# Altium project chinook_pcb_rotor.PrjPcb (part 1 of 2)
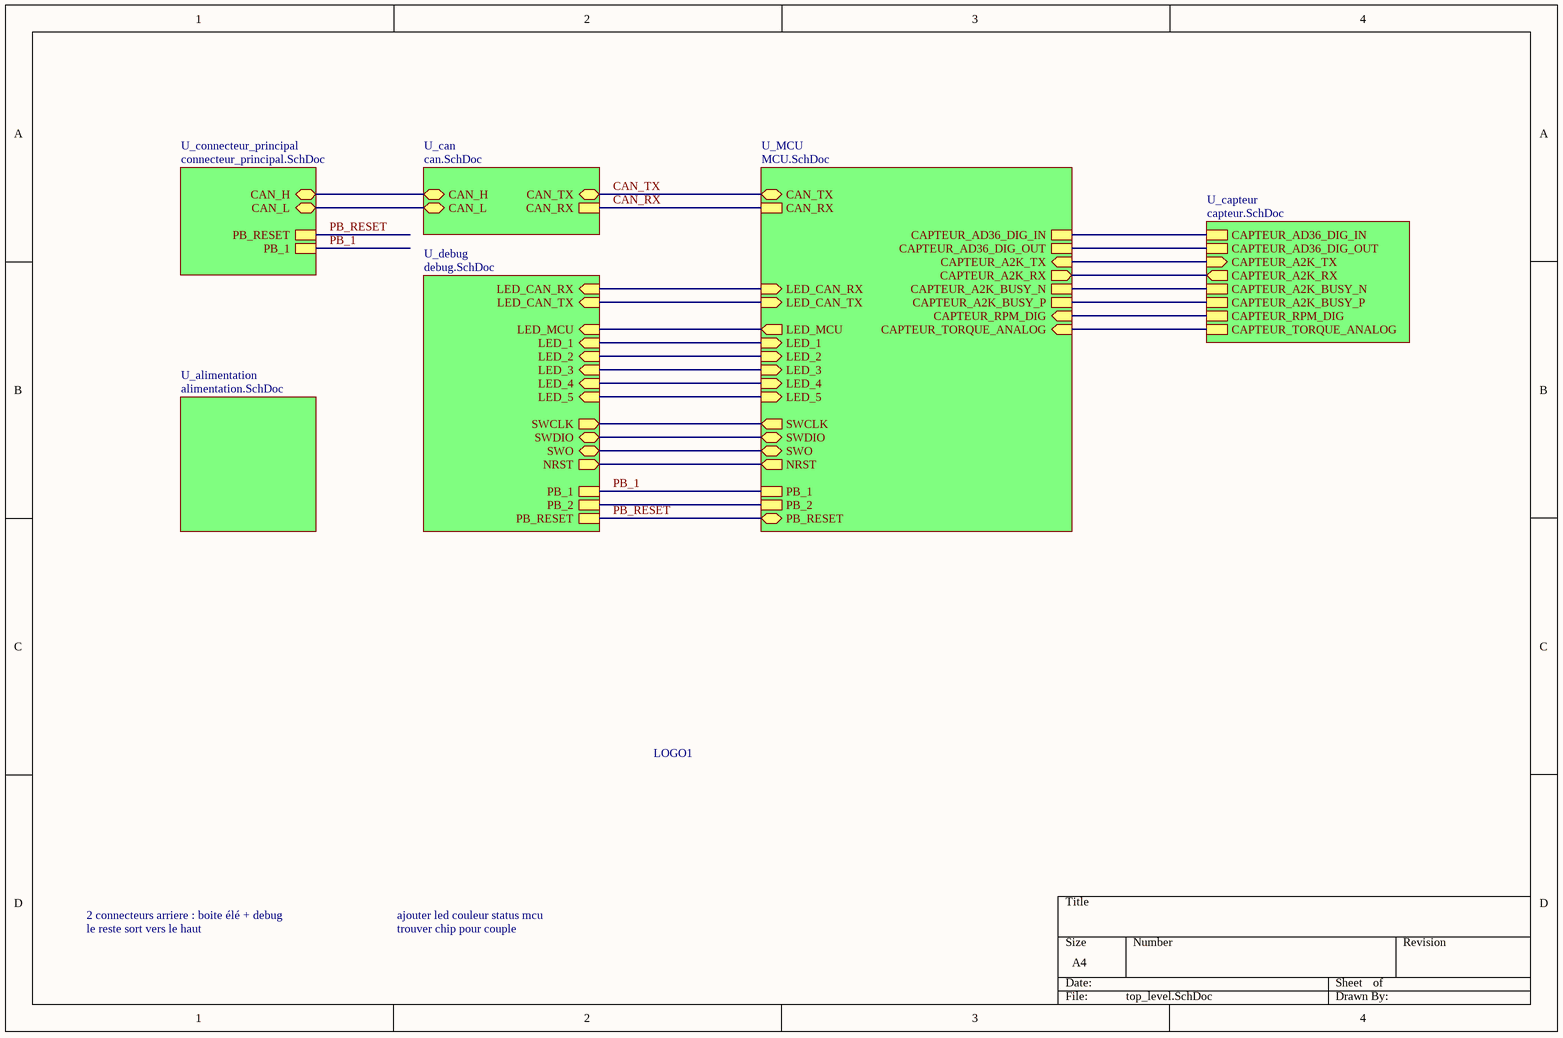
[diagram p0: top_level.SchDoc]
11 sheets, 93 parts. Net scope: hierarchical (ports join the sheet entries above them; power ports are global).
Board file: chinook_pcb_rotor.PcbDoc
Sheets:
  top_level.SchDoc
    U_MCU = MCU.SchDoc
    U_capteur = capteur.SchDoc
      U_capteur_couple = capteur_couple.SchDoc
      U_encodeur_pale = encodeur_pale.SchDoc
      U_encodeur_rotor_rpm = encodeur_rotor_rpm.SchDoc
    U_can = can.SchDoc
    U_debug = debug.SchDoc
      U_led = led.SchDoc
    U_alimentation = alimentation.SchDoc
    U_connecteur_principal = connecteur_principal.SchDoc

## Sheet top_level.SchDoc
size A4; SheetNumber: 1; SheetTotal: 11

### Parts
LOGO1  VOTRE NOM DE LOGO  [LOGO-CHINOOK]  (value not drawn)

### Sub-sheets
U_alimentation = alimentation.SchDoc: no entries
U_can = can.SchDoc: CAN_H (bidir), CAN_L (bidir), CAN_TX (bidir), CAN_RX
U_capteur = capteur.SchDoc: CAPTEUR_AD36_DIG_IN, CAPTEUR_AD36_DIG_OUT, CAPTEUR_A2K_TX (in), CAPTEUR_A2K_RX (out), CAPTEUR_A2K_BUSY_N, CAPTEUR_A2K_BUSY_P, CAPTEUR_RPM_DIG, CAPTEUR_TORQUE_ANALOG
U_connecteur_principal = connecteur_principal.SchDoc: CAN_H (bidir), CAN_L (bidir), PB_1, PB_RESET
U_debug = debug.SchDoc: LED_CAN_RX (in), LED_CAN_TX (in), SWCLK (out), SWDIO (bidir), SWO (bidir), NRST (out), LED_1 (in), LED_MCU (in), LED_2 (in), LED_3 (in), LED_4 (in), LED_5 (in), PB_1, PB_2, PB_RESET
U_MCU = MCU.SchDoc: SWCLK (out), SWDIO (bidir), SWO (bidir), NRST (out), CAPTEUR_AD36_DIG_IN, CAPTEUR_AD36_DIG_OUT, CAPTEUR_A2K_TX (in), CAPTEUR_A2K_RX (out), CAPTEUR_A2K_BUSY_N, CAPTEUR_A2K_BUSY_P, LED_CAN_RX (in), LED_CAN_TX (in), LED_1 (in), LED_2 (in), LED_3 (in), LED_4 (in), LED_5 (in), PB_1, CAPTEUR_TORQUE_ANALOG (in), CAN_RX, LED_MCU (out), PB_RESET (bidir), PB_2, CAPTEUR_RPM_DIG (in), CAN_TX (bidir)

### Nets
CAN_RX: sheet U_MCU/CAN_RX, sheet U_can/CAN_RX
CAN_TX: sheet U_MCU/CAN_TX, sheet U_can/CAN_TX
PB_1: sheet U_MCU/PB_1, sheet U_debug/PB_1, sheet U_connecteur_principal/PB_1
PB_2: sheet U_MCU/PB_2, sheet U_debug/PB_2
PB_RESET: sheet U_MCU/PB_RESET, sheet U_debug/PB_RESET, sheet U_connecteur_principal/PB_RESET
NetJ4_5: sheet U_can/CAN_H, sheet U_connecteur_principal/CAN_H
NetJ4_6: sheet U_can/CAN_L, sheet U_connecteur_principal/CAN_L
NetR14_2: sheet U_MCU/LED_MCU, sheet U_debug/LED_MCU
NetR18_1: sheet U_MCU/CAPTEUR_RPM_DIG, sheet U_capteur/CAPTEUR_RPM_DIG
NetR20_1: sheet U_MCU/CAPTEUR_TORQUE_ANALOG, sheet U_capteur/CAPTEUR_TORQUE_ANALOG
(unnamed): sheet U_MCU/SWCLK, sheet U_debug/SWCLK
(unnamed): sheet U_MCU/SWDIO, sheet U_debug/SWDIO
(unnamed): sheet U_MCU/SWO, sheet U_debug/SWO
(unnamed): sheet U_MCU/NRST, sheet U_debug/NRST
(unnamed): sheet U_MCU/CAPTEUR_AD36_DIG_IN, sheet U_capteur/CAPTEUR_AD36_DIG_IN
(unnamed): sheet U_MCU/CAPTEUR_AD36_DIG_OUT, sheet U_capteur/CAPTEUR_AD36_DIG_OUT
(unnamed): sheet U_MCU/CAPTEUR_A2K_TX, sheet U_capteur/CAPTEUR_A2K_TX
(unnamed): sheet U_MCU/CAPTEUR_A2K_RX, sheet U_capteur/CAPTEUR_A2K_RX
(unnamed): sheet U_MCU/CAPTEUR_A2K_BUSY_N, sheet U_capteur/CAPTEUR_A2K_BUSY_N
(unnamed): sheet U_MCU/CAPTEUR_A2K_BUSY_P, sheet U_capteur/CAPTEUR_A2K_BUSY_P
(unnamed): sheet U_MCU/LED_CAN_RX, sheet U_debug/LED_CAN_RX
(unnamed): sheet U_MCU/LED_CAN_TX, sheet U_debug/LED_CAN_TX
(unnamed): sheet U_MCU/LED_1, sheet U_debug/LED_1
(unnamed): sheet U_MCU/LED_2, sheet U_debug/LED_2
(unnamed): sheet U_MCU/LED_3, sheet U_debug/LED_3
(unnamed): sheet U_MCU/LED_4, sheet U_debug/LED_4
(unnamed): sheet U_MCU/LED_5, sheet U_debug/LED_5

### Notes on the sheet
- 2 connecteurs arriere : boite élé + debug
- ajouter led couleur status mcu
- le reste sort vers le haut
- trouver chip pour couple

### Library data of the parts
LOGO1 = LOGO - FOOTPRINT

## Sheet MCU.SchDoc
size A4; SheetNumber: 2; SheetTotal: 11
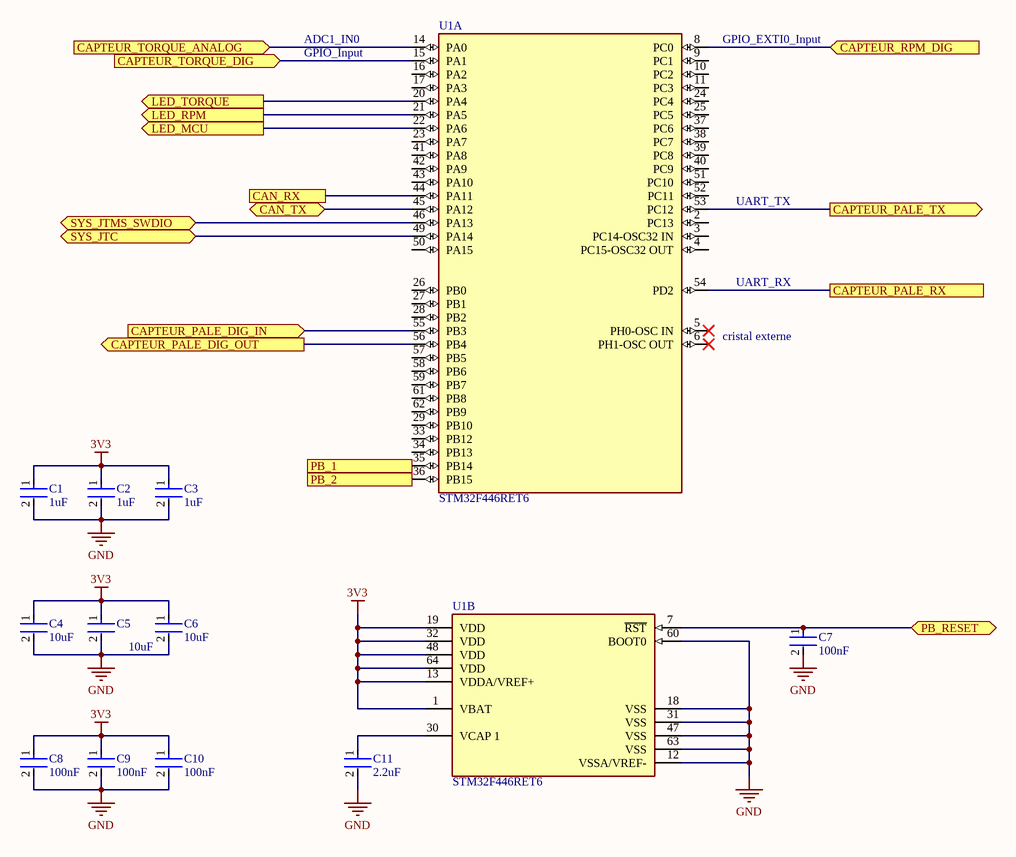
[diagram p1: MCU.SchDoc]

### Parts
C1  1uF  [FP-GRM155-0_05-IPC_A]
C2  1uF  [FP-GRM155-0_05-IPC_A]
C3  1uF  [FP-GRM155-0_05-IPC_A]
C4  10uF  [FP-GRM155-0_15-MFG]
C5  10uF  [FP-GRM155-0_15-MFG]
C6  10uF  [FP-GRM155-0_15-MFG]
C7  100nF  [FP-CL278-IPC_A]
C8  100nF  [FP-CL278-IPC_A]
C9  100nF  [FP-CL278-IPC_A]
C10  100nF  [FP-CL278-IPC_A]
C11  2.2uF  [FP-GRM155-0_05-MFG]
U1  STM32F446RET6  [FP-LQFP64-5W-IPC_A]  (parts A,B of 2)

### Ports
CAN_RX, CAN_TX (bidir), CAPTEUR_PALE_DIG_IN (in), CAPTEUR_PALE_DIG_OUT (out), CAPTEUR_PALE_RX, CAPTEUR_PALE_TX (out), CAPTEUR_RPM_DIG (in), CAPTEUR_TORQUE_ANALOG (in), CAPTEUR_TORQUE_DIG (in), LED_MCU (out), LED_RPM (out), LED_TORQUE (out), PB_1, PB_2, PB_RESET (bidir), SYS_JTC (bidir), SYS_JTMS_SWDIO (bidir)

### Nets
3V3: C1.1 C2.1 C3.1 C4.1 C5.1 C6.1 C8.1 C9.1 C10.1 U1.1(VBAT) U1.13(VDDA/VREF+) U1.19(VDD) U1.32(VDD) U1.48(VDD) U1.64(VDD)
GND: C1.2 C2.2 C3.2 C4.2 C5.2 C6.2 C7.2 C8.2 C9.2 C10.2 C11.2 U1.12(VSSA/VREF-) U1.18(VSS) U1.31(VSS) U1.47(VSS) U1.60(BOOT0) U1.63(VSS)
CAN_RX: U1.44(PA11) ; port CAN_RX
CAN_TX: U1.45(PA12) ; port CAN_TX
PB_1: U1.35(PB14) ; port PB_1
PB_2: U1.36(PB15) ; port PB_2
PB_RESET: C7.1 U1.7(~{RST}) ; port PB_RESET
NetC11_1: C11.1 U1.30(VCAP_1)
NetR14_2: U1.22(PA6) ; port LED_MCU
NetR18_1: U1.8(PC0) ; port CAPTEUR_RPM_DIG
NetR20_1: U1.14(PA0) ; port CAPTEUR_TORQUE_ANALOG
NetU1_15: U1.15(PA1) ; port CAPTEUR_TORQUE_DIG
NetU1_20: U1.20(PA4) ; port LED_TORQUE
NetU1_21: U1.21(PA5) ; port LED_RPM
NetU1_46: U1.46(PA13) ; port SYS_JTMS_SWDIO
NetU1_49: U1.49(PA14) ; port SYS_JTC
NetU1_53: U1.53(PC12) ; port CAPTEUR_PALE_TX
NetU1_54: U1.54(PD2) ; port CAPTEUR_PALE_RX
NetU1_55: U1.55(PB3) ; port CAPTEUR_PALE_DIG_IN
NetU1_56: U1.56(PB4) ; port CAPTEUR_PALE_DIG_OUT

Not connected (* = marked no-connect by the designer): U1 2(PC13) 3(PC14-OSC32_IN) 4(PC15-OSC32_OUT) 5(PH0-OSC_IN)* 6(PH1-OSC_OUT)* 9(PC1) 10(PC2) 11(PC3) 16(PA2) 17(PA3) 23(PA7) 24(PC4) 25(PC5) 26(PB0) 27(PB1) 28(PB2) 29(PB10) 33(PB12) 34(PB13) 37(PC6) 38(PC7) 39(PC8) 40(PC9) 41(PA8) 42(PA9) 43(PA10) 50(PA15) 51(PC10) 52(PC11) 57(PB5) 58(PB6) 59(PB7) 61(PB8) 62(PB9)

### Notes on the sheet
- ADC1_IN0
- GPIO_Input
- (near U1) GPIO_EXTI0_Input
- UART_TX
- (near U1) cristal externe
- UART_RX

### Library data of the parts
C1-C3 = GRM155R61E105MA12D: Multilayer Ceramic Capacitor, 1 uF, 25 V, ± 20%, X5R, 0402 [1005 Metric]; Manufacturer: Murata; Voltage Rating: 25V; Supplier: Digikey; Supplier Part Number: 490-10018-1-ND; Manufacturer Part Number: GRM155R61E105MA12D; RoHS: Yes; Category: Ceramic Capacitors; Stock: 2496490; Pricing: 1=0.1, 10=0.066, 50=0.0376, 100=0.0292, 500=0.022, 1000=0.01728, 2500=0.01571, 5000=0.01445 (USD); Mounting Technology: Surface Mount; Case/Package: 0402; Case Code (Metric): 1005; Case Code (Imperial): 0402; Weight: 0.000212oz; Min Operating Temperature: -55°C; Max Operating Temperature: 85°C; Value: 1uF; Packaging: Tape and Reel; Tolerance: 20%; Dielectric: X5R; Termination: SMD/SMT; Voltage Rating (DC): 25V; Package Quantity: 10000; Series: GRM; Length: 0.039inch; Width: 0.02inch; Height: 0.5mm; Thickness: 0.022inch; RoHS Compliant: Yes; ComponentLink1URL: http://www.mouser.com/ds/2/281/c02e-2905.pdf?src-supplier=Mouser; ComponentLink1Description: http://www.mouser.com/ds/2/281/c02e-2905.pdf?src-supplier=Mouser; ComponentLink2URL: https://datasheet.octopart.com/GRM155R61E105MA12D-Murata-datasheet-149523023.pdf?src-supplier=Newark; ComponentLink2Description: https://datasheet.octopart.com/GRM155R61E105MA12D-Murata-datasheet-149523023.pdf?src-supplier=Newark; ComponentLink3URL: https://datasheet.octopart.com/GRM155R61E105MA12D-Murata-datasheet-22122223.pdf?src-supplier=Future+Electronics; ComponentLink3Description: https://datasheet.octopart.com/GRM155R61E105MA12D-Murata-datasheet-22122223.pdf?src-supplier=Future+Electronics; ComponentLink4URL: http://search.murata.co.jp/Ceramy/image/img/A01X/G101/ENG/GRM155R61E105MA12-01.pdf?src-supplier=Digikey; ComponentLink4Description: http://search.murata.co.jp/Ceramy/image/img/A01X/G101/ENG/GRM155R61E105MA12-01.pdf?src-supplier=Digikey
C4-C6 = GRM155R60J106ME15D: Multilayer Ceramic Capacitor, 10 uF, 6.3 V, ± 20%, X5R, 0402 [1005 Metric]; Manufacturer: Murata; Material: 4241ConductorMaterial; Voltage Rating: 6.3V; Supplier: Digikey; Supplier Part Number: 490-13238-1-ND; Manufacturer Part Number: GRM155R60J106ME15D; RoHS: Yes; Category: Ceramic Capacitors; Stock: 6215687; Pricing: 1=0.17, 10=0.11, 50=0.0696, 100=0.0557, 500=0.04022, 1000=0.03558, 2500=0.03404, 5000=0.03094 (USD); Mounting Technology: Surface Mount; Case/Package: 0402; Case Code (Metric): 1005; Case Code (Imperial): 0402; Min Operating Temperature: -55°C; Max Operating Temperature: 85°C; Packaging: Cut Tape; Value: 10uF; Tolerance: 20%; Voltage Rating (DC): 6.3V; Dielectric: X5R; Series: GRM; Length: 0.039inch; Width: 0.02inch; Height: 650um; Thickness: 0.026inch; RoHS Compliant: Yes; ComponentLink1URL: https://datasheet.octopart.com/GRM155R60J106ME15D-Murata-datasheet-149522992.pdf?src-supplier=Newark; ComponentLink1Description: https://datasheet.octopart.com/GRM155R60J106ME15D-Murata-datasheet-149522992.pdf?src-supplier=Newark; ComponentLink2URL: https://www.murata.com/~/media/webrenewal/support/library/catalog/products/capacitor/mlcc/c02e.ashx?la=en-us&src-supplier=Digikey; ComponentLink2Description: https://www.murata.com/~/media/webrenewal/support/library/catalog/products/capacitor/mlcc/c02e.ashx?la=en-us&src-supplier=Digikey; ComponentLink3URL: https://datasheet.octopart.com/GRM155R60J106ME15D-Murata-datasheet-165579666.pdf?src-supplier=TME; ComponentLink3Description: https://datasheet.octopart.com/GRM155R60J106ME15D-Murata-datasheet-165579666.pdf?src-supplier=TME
C7-C10 = CL05A104KA5NNNC: Multilayer Ceramic Capacitor, 0.1 uF, 25 V, ± 10%, X5R, 0402 [1005 Metric]; Manufacturer: Samsung; Material: 4241ConductorMaterial; Voltage Rating: 25V; Supplier: Digikey; Supplier Part Number: 1276-1043-1-ND; Manufacturer Part Number: CL05A104KA5NNNC; RoHS: Yes; Category: Ceramic Capacitors; Stock: 11930039; Pricing: 1=0.1, 10=0.01, 50=0.0054, 100=0.0042, 500=0.00318, 1000=0.0025, 2500=0.00227, 5000=0.00209 (USD); Mounting Technology: Surface Mount; Case/Package: 0402; Case Code (Metric): 1005; Case Code (Imperial): 0402; Min Operating Temperature: -55°C; Max Operating Temperature: 85°C; Value: 100nF; Packaging: Tape and Reel; Tolerance: 10%; Dielectric: X5R; Voltage: 25V; Series: CL; Construction: Flat; Package Quantity: 1; Voltage Rating (DC): 25V; Length: 1mm; Width: 0.02inch; Height: 0.5mm; Depth: 0.5mm; Thickness: 0.022inch; Radiation Hardening: No; RoHS Compliant: Yes; Lead Free: Lead Free; ComponentLink1URL: https://datasheet.ciiva.com/25802/cl05a104ka5nnnc-25802704.pdf?src-supplier=Digikey; ComponentLink1Description: https://datasheet.ciiva.com/25802/cl05a104ka5nnnc-25802704.pdf?src-supplier=Digikey; ComponentLink2URL: https://datasheet.ciiva.com/16437/cl05a104ka5nnnc-16437369.pdf?src-supplier=Future+Electronics; ComponentLink2Description: https://datasheet.ciiva.com/16437/cl05a104ka5nnnc-16437369.pdf?src-supplier=Future+Electronics; ComponentLink3URL: https://datasheet.ciiva.com/26838/getdatasheetpartid-357412-26838142.pdf?src-supplier=Verical; ComponentLink3Description: https://datasheet.ciiva.com/26838/getdatasheetpartid-357412-26838142.pdf?src-supplier=Verical; ComponentLink4URL: https://datasheet.ciiva.com/26309/mlcc-catalogdownload2013-eng-26309014.pdf?src-supplier=Distrelec; ComponentLink4Description: https://datasheet.ciiva.com/26309/mlcc-catalogdownload2013-eng-26309014.pdf?src-supplier=Distrelec
C11 = GRM155C80J225KE95D: Cap Ceramic 2.2uF 6.3V X6S 10% Pad SMD 0402 105°C T/R; Manufacturer: Murata; Supplier: Digikey; Supplier Part Number: 490-10012-1-ND; Manufacturer Part Number: GRM155C80J225KE95D; RoHS: Yes; Category: Ceramic Capacitors; Stock: 6441444; Pricing: 1=0.1, 10=0.054, 50=0.031, 100=0.0241, 500=0.01814, 1000=0.01425, 2500=0.01296, 5000=0.01192 (USD); Mounting Technology: Surface Mount; Case/Package: 0402; Case Code (Metric): 1005; Material: Ceramic; Case Code (Imperial): 0402; Min Operating Temperature: -55°C; Max Operating Temperature: 105°C; Tolerance: 10%; Value: 2.2uF; Packaging: Cut Tape; Voltage Rating: 6.3V; Voltage Rating (DC): 6.3V; Series: GRM; Length: 0.039inch; Width: 0.02inch; Height: 0.3mm; Thickness: 0.022inch; RoHS Compliant: Yes; ComponentLink1URL: http://search.murata.co.jp/Ceramy/image/img/A01X/G101/ENG/GRM155C80J225KE95-01.pdf?src-supplier=Digikey; ComponentLink1Description: http://search.murata.co.jp/Ceramy/image/img/A01X/G101/ENG/GRM155C80J225KE95-01.pdf?src-supplier=Digikey; ComponentLink2URL: http://search.murata.co.jp/Ceramy/image/img/A01X/partnumbering_e_01.pdf?src-supplier=Digikey; ComponentLink2Description: http://search.murata.co.jp/Ceramy/image/img/A01X/partnumbering_e_01.pdf?src-supplier=Digikey; ComponentLink3URL: https://datasheet.octopart.com/GRM155C80J225KE95D-Murata-datasheet-32479577.pdf?src-supplier=Future+Electronics; ComponentLink3Description: https://datasheet.octopart.com/GRM155C80J225KE95D-Murata-datasheet-32479577.pdf?src-supplier=Future+Electronics; ComponentLink4URL: https://datasheet.octopart.com/GRM155C80J225KE95D-Murata-datasheet-165579666.pdf?src-supplier=TME; ComponentLink4Description: https://datasheet.octopart.com/GRM155C80J225KE95D-Murata-datasheet-165579666.pdf?src-supplier=TME
U1 = STM32F446RET6: MCU 32-bit ARM Cortex M4 RISC 512KB Flash 2.5V/3.3V Medical 64-Pin LQFP Frame; Manufacturer: STMicroelectronics; Frequency: 180MHz; Number of I/Os: 50; RAM Size: 128KB; Min Supply Voltage: 1.7V; Max Supply Voltage: 3.6V; Nominal Supply Current: 1.12uA; Number of A/D Converters: 3NUMBER; Number of Channels: 16NUMBER; Number of D/A Converters: 2NUMBER; Number of I2C Channels: 4NUMBER; Interface: I2C,SPI,USB,CAN,IrDA,SD,UART,USART,LIN,EBI/EMI; Oscillator Type: Internal; Peripherals: Brown-out Detect/Reset,POR,PWM,WDT,DMA,LVD; Supplier: Digikey; Supplier Part Number: 497-15376-ND; Manufacturer Part Number: STM32F446RET6; RoHS: Yes; Category: Microcontrollers; Stock: 9780; Pricing: 1=10.05, 10=9.077, 25=8.6544, 160=7.51463, 320=7.17688, 480=6.54363, 960=5.69929 (USD); Case/Package: LQFP; Pins: 64; Min Operating Temperature: -40°C; Max Operating Temperature: 85°C; Core Architecture: ARM; Memory Size: 512KB; Series: STM32 F4; Density: 512KB; Number of SPI Channels: 3NUMBER; Number of UART Channels: 2NUMBER; Packaging: Tray; Memory Format: FLASH; Number of ADC Channels: 16NUMBER; Number of PWM Channels: 4NUMBER; Number of USB Channels: 2NUMBER; Height: 1.6mm; Reach SVHC Compliant: No; Lead Free: Lead Free; RoHS Compliant: Yes; ComponentLink1URL: http://www.farnell.com/datasheets/2309063.pdf?src-supplier=Farnell; ComponentLink1Description: http://www.farnell.com/datasheets/2309063.pdf?src-supplier=Farnell; ComponentLink2URL: http://www.mouser.com/ds/2/389/stm32f446mc-956216.pdf?src-supplier=Mouser; ComponentLink2Description: http://www.mouser.com/ds/2/389/stm32f446mc-956216.pdf?src-supplier=Mouser; ComponentLink3URL: https://datasheet.octopart.com/STM32F446RET6-STMicroelectronics-datasheet-58295083.pdf?src-supplier=Future+Electronics; ComponentLink3Description: https://datasheet.octopart.com/STM32F446RET6-STMicroelectronics-datasheet-58295083.pdf?src-supplier=Future+Electronics; ComponentLink4URL: http://www.st.com/content/ccc/resource/technical/document/datasheet/65/cb/75/50/53/d6/48/24/DM00141306.pdf/files/DM00141306.pdf/jcr:content/translations/en.DM00141306.pdf?src-supplier=Digikey; ComponentLink4Description: http://www.st.com/content/ccc/resource/technical/document/datasheet/65/cb/75/50/53/d6/48/24/DM00141306.pdf/files/DM00141306.pdf/jcr:content/translations/en.DM00141306.pdf?src-supplier=Digikey; ComponentLink5URL: https://datasheet.octopart.com/STM32F446RET6-STMicroelectronics-datasheet-41797127.pdf?src-supplier=Element14; ComponentLink5Description: https://datasheet.octopart.com/STM32F446RET6-STMicroelectronics-datasheet-41797127.pdf?src-supplier=Element14; ComponentLink6URL: http://www.farnell.com/datasheets/2309063.pdf?src-supplier=Newark; ComponentLink6Description: http://www.farnell.com/datasheets/2309063.pdf?src-supplier=Newark; ComponentLink7URL: http://www.farnell.com/datasheets/2309063.pdf?src-supplier=Element14; ComponentLink7Description: http://www.farnell.com/datasheets/2309063.pdf?src-supplier=Element14; ComponentLink8URL: https://datasheet.octopart.com/STM32F446RET6-STMicroelectronics-datasheet-83961502.pdf?src-supplier=SHENGYU+ELECTRONICS; ComponentLink8Description: https://datasheet.octopart.com/STM32F446RET6-STMicroelectronics-datasheet-83961502.pdf?src-supplier=SHENGYU+ELECTRONICS

## Sheet capteur.SchDoc
size A4; SheetNumber: 3; SheetTotal: 11
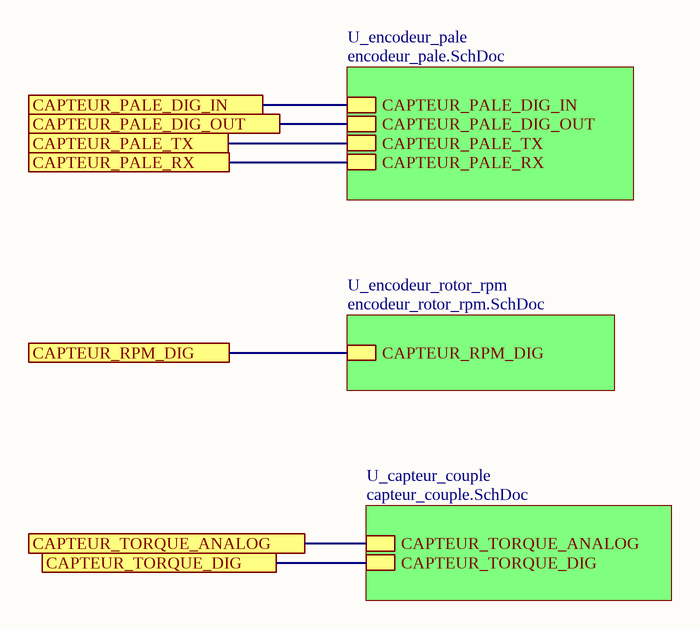
[diagram p2: capteur.SchDoc]

### Sub-sheets
U_capteur_couple = capteur_couple.SchDoc: CAPTEUR_TORQUE_ANALOG, CAPTEUR_TORQUE_DIG
U_encodeur_pale = encodeur_pale.SchDoc: CAPTEUR_PALE_DIG_IN, CAPTEUR_PALE_DIG_OUT, CAPTEUR_PALE_TX, CAPTEUR_PALE_RX
U_encodeur_rotor_rpm = encodeur_rotor_rpm.SchDoc: CAPTEUR_RPM_DIG

### Ports
CAPTEUR_PALE_DIG_IN, CAPTEUR_PALE_DIG_OUT, CAPTEUR_PALE_RX, CAPTEUR_PALE_TX, CAPTEUR_RPM_DIG, CAPTEUR_TORQUE_ANALOG, CAPTEUR_TORQUE_DIG

### Nets
NetR18_1: port CAPTEUR_RPM_DIG, sheet U_encodeur_rotor_rpm/CAPTEUR_RPM_DIG
NetR20_1: port CAPTEUR_TORQUE_ANALOG, port CAPTEUR_TORQUE_DIG, sheet U_capteur_couple/CAPTEUR_TORQUE_ANALOG, sheet U_capteur_couple/CAPTEUR_TORQUE_DIG
(unnamed): port CAPTEUR_PALE_DIG_IN, sheet U_encodeur_pale/CAPTEUR_PALE_DIG_IN
(unnamed): port CAPTEUR_PALE_DIG_OUT, sheet U_encodeur_pale/CAPTEUR_PALE_DIG_OUT
(unnamed): port CAPTEUR_PALE_TX, sheet U_encodeur_pale/CAPTEUR_PALE_TX
(unnamed): port CAPTEUR_PALE_RX, sheet U_encodeur_pale/CAPTEUR_PALE_RX

## Sheet capteur_couple.SchDoc
size A4; SheetNumber: 6; SheetTotal: 11
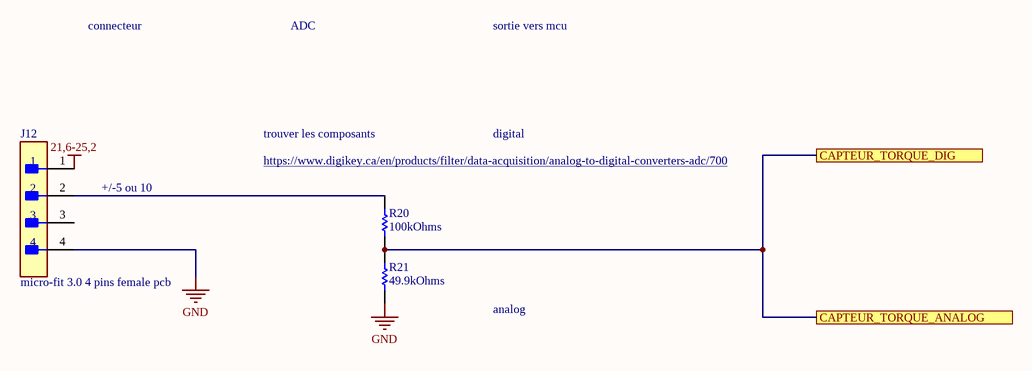
[diagram p3: capteur_couple.SchDoc]

### Parts
J12  micro-fit 3.0 4 pins female pcb  [FP-43045-0400-MFG]
R20  100kOhms  [RESC1005X40X25NL05T10]
R21  49.9kOhms  [RESC1005X40X25LL05T10]

### Ports
CAPTEUR_TORQUE_ANALOG, CAPTEUR_TORQUE_DIG

### Nets
21,6-25,2: J12.1
GND: J12.4 R21.1
NetJ12_2: J12.2 R20.2
NetR20_1: R20.1 R21.2 ; port CAPTEUR_TORQUE_ANALOG, port CAPTEUR_TORQUE_DIG

Not connected (* = marked no-connect by the designer): J12 3

### Notes on the sheet
- connecteur
- ADC
- sortie vers mcu
- trouver les composants
- (near R20) https://www.digikey.ca/en/products/filter/data-acquisition/analog-to-digital-converters-adc/700
- digital
- +/-5 ou 10
- analog

### Library data of the parts
J12 = 430450400: MOLEX 43045-0400 Header, Dual Row, 90°, 4p, Tin Plating Snap-in Peg PCB Lock, GW Compatible; Plating: 154ConductorMaterial; Number of Contacts: 4; Contact Resistance: 10mR; Max Voltage Rating (AC): 250V; Current Rating: 5A; Voltage Rating: 600V; Gender: Male; Max Voltage Rating (DC): 250.25kV; Pitch: 3mm; Row Spacing: 0.118inch; Approvals: UL,CSA,TUV; Glow Wire Compliant: 15Compliance; Supplier: Digikey; Supplier Part Number: WM1814-ND; Manufacturer: Molex; Manufacturer Part Number: 43045-0400; RoHS: Yes; Category: Headers and Wire Housings; Stock: 4691; Pricing: 1=1.51, 10=1.289, 80=1.065, 2232=0.8128, 6696=0.74553, 11160=0.72872 (USD); Mounting Technology: Through Hole; Case/Package: 101Case; Contact Plating: Tin; Contact Material: Brass,Tin; Color: Black; Housing Color: Black; Housing Material: Thermoplastic; Material: Polyester; Min Operating Temperature: -40°C; Max Operating Temperature: 105°C; Number of Rows: 2; Termination: Solder; Packaging: Tray; Fastening Type: Ramp; Number of Positions: 4; Orientation: Right Angle; Contact Gender: Male; Series: Micro-Fit 3.0™ 43045; Contact Type: Male Pin; Number of Circuits: 4; Number of Poles: 4; Voltage Rating (AC): 250V; Working Voltage: 250V; Voltage Rating (DC): 250V; Diameter: 3mm; Length: 10.15mm; Width: 9.9mm; Lead Pitch: 3mm; Depth: 12.2mm; Radiation Hardening: No; RoHS Compliant: Yes; Reach SVHC Compliant: Unknown; Flammability Rating: 5813Flammability; Halogen Free: 5696HalogenFree; Lead Free: 5697LeadFree; ComponentLink1URL: https://datasheet.ciiva.com/11746/0900766b80027348-11746988.pdf?src-supplier=Rs; ComponentLink1Description: https://datasheet.ciiva.com/11746/0900766b80027348-11746988.pdf?src-supplier=Rs
R20 = RC0402FR-07100KL: SMD Chip Resistor, 100 kOhm, ± 1%, 63 mW, 0402 [1005 Metric], Thick Film, General Purpose; Manufacturer: Yageo; Value: 100kR; Temperature Coefficient: 100ppm/°C; Power Rating: 63mW; Voltage Rating: 50V; Supplier: Digikey; Supplier Part Number: 311-100KLRCT-ND; Manufacturer Part Number: RC0402FR-07100KL; RoHS: Yes; Category: Chip SMD Resistors; Stock: 21909209; Pricing: 1=0.1, 10=0.015, 50=0.0088, 100=0.0073, 500=0.00488, 1000=0.00417, 5000=0.00297 (USD); Case/Package: 0402; Case Code (Metric): 1005; Case Code (Imperial): 0402; Min Operating Temperature: -55°C; Max Operating Temperature: 155°C; Resistor Type: Thick Film; Tolerance: 1%; Packaging: Tape and Reel; Package Quantity: 1; Number of Terminations: 2; Termination: SMD/SMT; Max Power Dissipation: 63mW; Features: Moisture Resistant; Series: RC; Resistance Tolerance: 1%; Construction: Rectangular; Technology: THICK FILM; Voltage Rating (AC): 50V; Length: 0.039inch; Width: 0.02inch; Height: 0.016inch; Depth: 0.5mm; Reach SVHC Compliant: No; RoHS Compliant: Yes; Lead Free: 5697LeadFree; Military Standard: Not; ComponentLink1URL: https://datasheet.ciiva.com/11819/0900766b80c66297-11819452.pdf?src-supplier=Rs; ComponentLink1Description: https://datasheet.ciiva.com/11819/0900766b80c66297-11819452.pdf?src-supplier=Rs; ComponentLink2URL: https://datasheet.ciiva.com/22747/1018594-22747509.pdf?src-supplier=Element14; ComponentLink2Description: https://datasheet.ciiva.com/22747/1018594-22747509.pdf?src-supplier=Element14; ComponentLink3URL: https://datasheet.ciiva.com/2453/pyu-r-int-thick-7-2453362.pdf?src-supplier=Digikey; ComponentLink3Description: https://datasheet.ciiva.com/2453/pyu-r-int-thick-7-2453362.pdf?src-supplier=Digikey; ComponentLink4URL: https://datasheet.ciiva.com/12667/pyu-rc0402-51-rohs-l-6-r-12667930.pdf?src-supplier=Mouser; ComponentLink4Description: https://datasheet.ciiva.com/12667/pyu-rc0402-51-rohs-l-6-r-12667930.pdf?src-supplier=Mouser; ComponentLink5URL: https://datasheet.ciiva.com/15189/getdatasheetpartid-323696-15189334.pdf?src-supplier=Verical; ComponentLink5Description: https://datasheet.ciiva.com/15189/getdatasheetpartid-323696-15189334.pdf?src-supplier=Verical; ComponentLink6URL: https://datasheet.ciiva.com/2453/pyu-r-int-thick-7-2453363.pdf?src-supplier=Digikey; ComponentLink6Description: https://datasheet.ciiva.com/2453/pyu-r-int-thick-7-2453363.pdf?src-supplier=Digikey; ComponentLink7URL: https://datasheet.ciiva.com/2453/pyu-r-int-thick-7-2453361.pdf?src-supplier=Digikey; ComponentLink7Description: https://datasheet.ciiva.com/2453/pyu-r-int-thick-7-2453361.pdf?src-supplier=Digikey
R21 = RC0402FR-0749K9L: Supplier 1: Future Electronics; Supplier Part Number 1: 3276235

## Sheet encodeur_pale.SchDoc
size A4; SheetNumber: 4; SheetTotal: 11
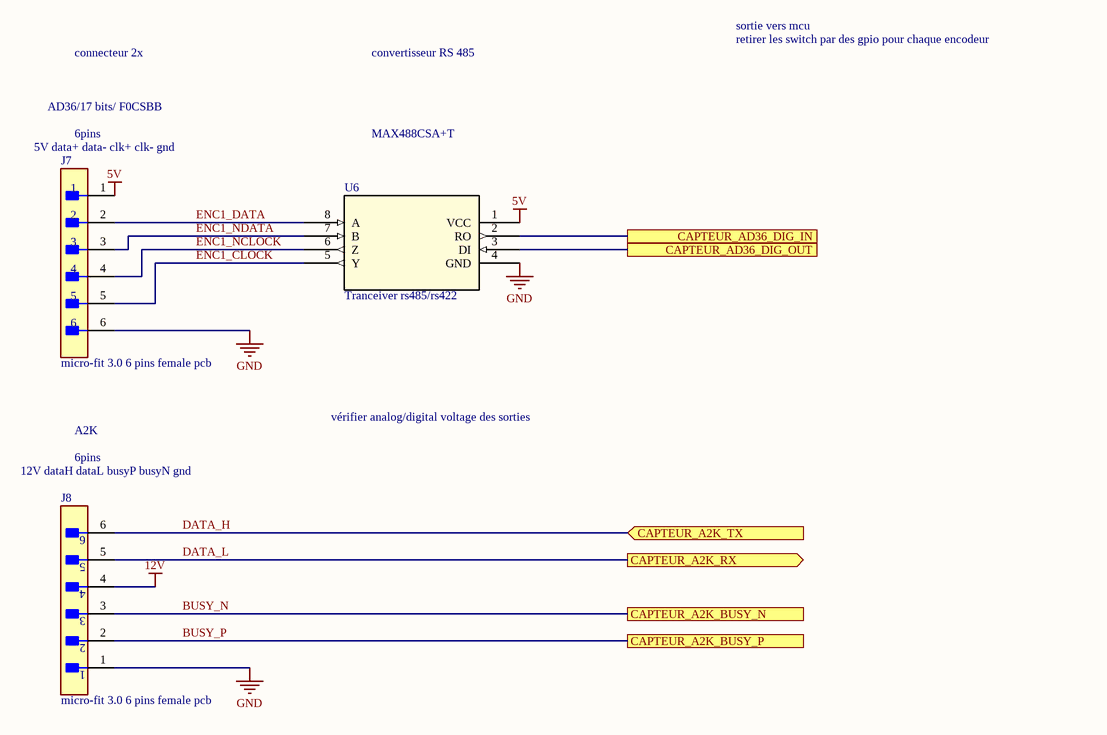
[diagram p4: encodeur_pale.SchDoc]

### Parts
(Parts that share a designator on the sheet are numbered #1, #2 ... from top to bottom, then left to right.)
J7  micro-fit 3.0 6 pins female pcb  [FP-0430450600-MFG]
J8  micro-fit 3.0 6 pins female pcb  [FP-0430450600-MFG]
U6#1  Tranceiver rs485/rs422  [21-0041_S8+2_MXM-M]

### Ports
CAPTEUR_A2K_BUSY_N, CAPTEUR_A2K_BUSY_P, CAPTEUR_A2K_RX (out), CAPTEUR_A2K_TX (in), CAPTEUR_AD36_DIG_IN, CAPTEUR_AD36_DIG_OUT

### Nets
5V: J7.1 U6#1.1(VCC)
12V: J8.4
GND: J7.6 J8.1 U6#1.4(GND)
BUSY_N: J8.3 ; port CAPTEUR_A2K_BUSY_N
BUSY_P: J8.2 ; port CAPTEUR_A2K_BUSY_P
DATA_H: J8.6 ; port CAPTEUR_A2K_TX
DATA_L: J8.5 ; port CAPTEUR_A2K_RX
ENC1_CLOCK: J7.5 U6#1.5(Y)
ENC1_DATA: J7.2 U6#1.8(A)
ENC1_NCLOCK: J7.4 U6#1.6(Z)
ENC1_NDATA: J7.3 U6#1.7(B)
NetU6#1_2: U6#1.2(RO) ; port CAPTEUR_AD36_DIG_IN
NetU6#1_3: U6#1.3(DI) ; port CAPTEUR_AD36_DIG_OUT

### Notes on the sheet
- connecteur 2x
- convertisseur RS 485
- sortie vers mcu
- retirer les switch par des gpio pour chaque encodeur
- (near J7) 5V data+ data- clk+ clk- gnd
- AD36/17 bits/ F0CSBB
- 6pins
- MAX488CSA+T
- vérifier analog/digital voltage des sorties
- 12V dataH dataL busyP busyN gnd
- A2K

### Library data of the parts
J7 J8 = 430450600: Connector Wire to Board Header 6 Position 3mm Solder Right Angle Thru-Hole Tray; Manufacturer: Molex; Manufacturer Part Number: 43045-0600; Plating: 154ConductorMaterial; Contact Resistance: 10mR; Voltage Rating: 250V; Current Rating: 5A; Max Voltage Rating (DC): 250.25kV; Gender: Male; Number of Positions: 6; Insulation Resistance: 1GR; Approvals: UL,CSA,TUV; Glow Wire Compliant: 15Compliance; Supplier: Digikey; Supplier Part Number: WM1815-ND; RoHS: Yes; Category: Headers and Wire Housings; Stock: 3053; Pricing: 1=2.2, 10=1.875, 80=1.54863, 1728=1.18185, 5184=1.08404 (USD); Mounting Technology: Through Hole; Case/Package: SMC; Contact Material: Brass,Tin; Contact Plating: Tin; Housing Color: Black; Housing Material: Thermoplastic; Color: Black; Material: 4301ConductorMaterial; Min Operating Temperature: -40°C; Max Operating Temperature: 105°C; Number of Rows: 2; Packaging: Tray; Termination: Solder; Orientation: Right Angle; Package Quantity: 1728; Max Current Rating: 5A; Number of Circuits: 6; Number of Contacts: 6; Series: 43045; Voltage Rating (DC): 250V; Diameter: 3mm; Length: 13.15mm; Height: 8.77mm; Pitch: 3mm; Depth: 12.2mm; Row Spacing: 3mm; Radiation Hardening: No; Flammability Rating: UL94 V-0; RoHS Compliant: Yes; Reach SVHC Compliant: Unknown; Halogen Free: 5696HalogenFree; Lead Free: 5697LeadFree; Parameter 1: *
U6#1 = MAX488CSA+T: MAX488 Series 0.25 Mbps 12 V Full Duplex SMT RS 485 Transceiver - SOIC-8; Manufacturer: Maxim; Number of Receivers: 1; Operating Supply Voltage: 5V; Logic Function: Transceiver,Receiver; Data Rate: 250Kbps; Supply Current: 250uA; Supplier: Digikey; Supplier Part Number: MAX488CSA+TCT-ND; Manufacturer Part Number: MAX488CSA+T; RoHS: Yes; Category: Buffers, Drivers and Transceivers; Stock: 8351; Pricing: 1=4.22, 10=3.788, 25=3.5808, 100=3.1034, 250=2.9442, 500=2.64184, 1000=2.22805 (USD); Mounting Technology: Surface Mount; Case/Package: SOIC; Min Operating Temperature: 0°C; Max Operating Temperature: 70°C; Packaging: Tape and Reel; Number of Transmitters: 1; Number of Drivers: 1; Number of Transceivers: 1; Series: -; Package Quantity: 2500; Radiation Hardening: No; Lead Free: Lead Free; RoHS Compliant: Yes; ComponentLink1URL: https://datasheet.ciiva.com/14430/max1487-max491-14430333.pdf?src-supplier=Avnet; ComponentLink1Description: https://datasheet.ciiva.com/14430/max1487-max491-14430333.pdf?src-supplier=Avnet; ComponentLink2URL: https://datasheet.ciiva.com/14430/max1487-max491-14430886.pdf?src-supplier=Avnet; ComponentLink2Description: https://datasheet.ciiva.com/14430/max1487-max491-14430886.pdf?src-supplier=Avnet; ComponentLink3URL: https://datasheet.ciiva.com/1774/max1487-max491-1774524.pdf?src-supplier=Digikey; ComponentLink3Description: https://datasheet.ciiva.com/1774/max1487-max491-1774524.pdf?src-supplier=Digikey

## Sheet encodeur_rotor_rpm.SchDoc
size A4; SheetNumber: 6; SheetTotal: 12
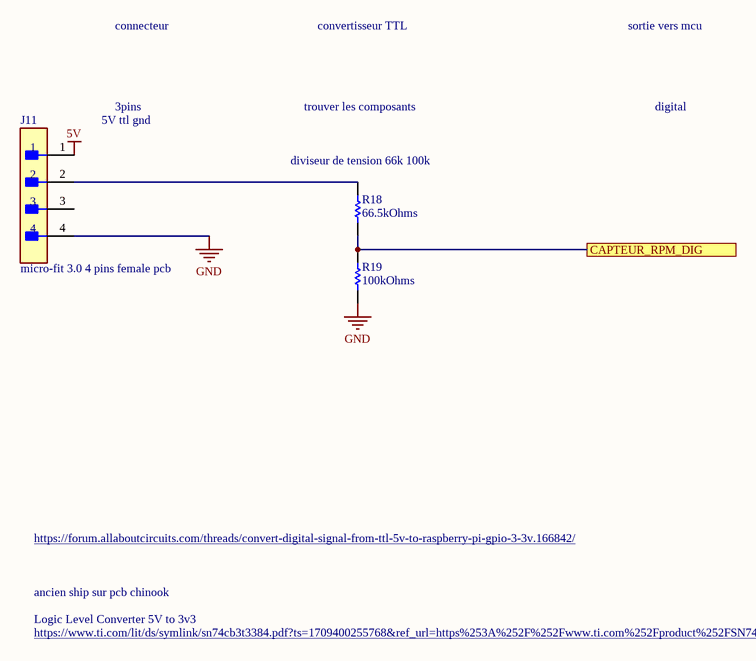
[diagram p5: encodeur_rotor_rpm.SchDoc]

### Parts
J11  micro-fit 3.0 4 pins female pcb  [FP-43045-0400-MFG]
R18  66.5kOhms  [RESC1005X40X25LL05T10]
R19  100kOhms  [RESC1005X40X25NL05T10]

### Ports
CAPTEUR_RPM_DIG

### Nets
5V: J11.1
GND: J11.4 R19.1
NetJ11_2: J11.2 R18.2
NetR18_1: R18.1 R19.2 ; port CAPTEUR_RPM_DIG

Not connected (* = marked no-connect by the designer): J11 3

### Notes on the sheet
- connecteur
- convertisseur TTL
- sortie vers mcu
- 5V ttl gnd
- 3pins
- trouver les composants
- digital
- (near R18) diviseur de tension 66k 100k
- https://forum.allaboutcircuits.com/threads/convert-digital-signal-from-ttl-5v-to-raspberry-pi-gpio-3-3v.166842/
- Logic Level Converter 5V to 3v3
- ancien ship sur pcb chinook
- https://www.ti.com/lit/ds/symlink/sn74cb3t3384.pdf?ts=1709400255768&ref_url=https%253A%252F%252Fwww.ti.com%252Fproduct%252FSN74CB3T3384%253FHQS%253Dti-null-null-verifimanuf_manuf-manu-pf-octopart-wwe

### Library data of the parts
J11 = 430450400: as J12 on sheet capteur_couple; Supplier: Digikey; Supplier Part Number: WM1814-ND; Manufacturer: Molex; Manufacturer Part Number: 43045-0400; RoHS: Yes; Category: Headers and Wire Housings; Stock: 4691; Pricing: 1=1.51, 10=1.289, 80=1.065, 2232=0.8128, 6696=0.74553, 11160=0.72872 (USD); Mounting Technology: Through Hole; Case/Package: 101Case; Contact Plating: Tin; Contact Material: Brass,Tin; Color: Black; Housing Color: Black; Housing Material: Thermoplastic; Material: Polyester; Min Operating Temperature: -40°C; Max Operating Temperature: 105°C; Number of Rows: 2; Termination: Solder; Packaging: Tray; Fastening Type: Ramp; Number of Positions: 4; Orientation: Right Angle; Contact Gender: Male; Series: Micro-Fit 3.0™ 43045; Contact Type: Male Pin; Number of Circuits: 4; Number of Poles: 4; Voltage Rating (AC): 250V; Working Voltage: 250V; Voltage Rating (DC): 250V; Diameter: 3mm; Length: 10.15mm; Width: 9.9mm; Lead Pitch: 3mm; Depth: 12.2mm; Radiation Hardening: No; RoHS Compliant: Yes; Reach SVHC Compliant: Unknown; Flammability Rating: 5813Flammability; Halogen Free: 5696HalogenFree; Lead Free: 5697LeadFree; ComponentLink1URL: https://datasheet.ciiva.com/11746/0900766b80027348-11746988.pdf?src-supplier=Rs; ComponentLink1Description: https://datasheet.ciiva.com/11746/0900766b80027348-11746988.pdf?src-supplier=Rs
R18 = RC0402FR-0766K5L: SMD Chip Resistor, 66.5 kOhm, ± 1%, 63 mW, 0402 [1005 Metric], Thick Film, General Purpose; Manufacturer: Yageo; Value: 66.5kR; Temperature Coefficient: 100ppm/°C; Power Rating: 62.5mW; Voltage Rating: 50V; Max Power Dissipation: 63mW; Supplier: Digikey; Supplier Part Number: YAG3209CT-ND; Manufacturer Part Number: RC0402FR-0766K5L; RoHS: Yes; Category: Chip SMD Resistors; Stock: 358270; Pricing: 1=0.1, 10=0.015, 50=0.0088, 100=0.0073, 500=0.00488, 1000=0.00417, 5000=0.00297 (USD); Case/Package: 0402; Contact Plating: Tin,Matte; Case Code (Imperial): 0402; Case Code (Metric): 1005; Min Operating Temperature: -55°C; Max Operating Temperature: 155°C; Tolerance: 1%; Packaging: Tape and Reel; Number of Terminations: 2; Termination: SMD/SMT; Features: Moisture Resistant; Series: RC; Length: 0.039inch; Width: 0.5mm; Height: 0.016inch; Lead Free: Lead Free; RoHS Compliant: Yes; ComponentLink1URL: https://datasheet.ciiva.com/8888/pyu-rc0402-51-rohs-l-6-8888485.pdf?src-supplier=Avnet; ComponentLink1Description: https://datasheet.ciiva.com/8888/pyu-rc0402-51-rohs-l-6-8888485.pdf?src-supplier=Avnet
R19 = RC0402FR-07100KL: as R20 on sheet capteur_couple; Supplier: Digikey; Supplier Part Number: 311-100KLRCT-ND; Manufacturer Part Number: RC0402FR-07100KL; RoHS: Yes; Category: Chip SMD Resistors; Stock: 21909209; Pricing: 1=0.1, 10=0.015, 50=0.0088, 100=0.0073, 500=0.00488, 1000=0.00417, 5000=0.00297 (USD); Case/Package: 0402; Case Code (Metric): 1005; Case Code (Imperial): 0402; Min Operating Temperature: -55°C; Max Operating Temperature: 155°C; Resistor Type: Thick Film; Tolerance: 1%; Packaging: Tape and Reel; Package Quantity: 1; Number of Terminations: 2; Termination: SMD/SMT; Max Power Dissipation: 63mW; Features: Moisture Resistant; Series: RC; Resistance Tolerance: 1%; Construction: Rectangular; Technology: THICK FILM; Voltage Rating (AC): 50V; Length: 0.039inch; Width: 0.02inch; Height: 0.016inch; Depth: 0.5mm; Reach SVHC Compliant: No; RoHS Compliant: Yes; Lead Free: 5697LeadFree; Military Standard: Not; ComponentLink1URL: https://datasheet.ciiva.com/11819/0900766b80c66297-11819452.pdf?src-supplier=Rs; ComponentLink1Description: https://datasheet.ciiva.com/11819/0900766b80c66297-11819452.pdf?src-supplier=Rs; ComponentLink2URL: https://datasheet.ciiva.com/22747/1018594-22747509.pdf?src-supplier=Element14; ComponentLink2Description: https://datasheet.ciiva.com/22747/1018594-22747509.pdf?src-supplier=Element14; ComponentLink3URL: https://datasheet.ciiva.com/2453/pyu-r-int-thick-7-2453362.pdf?src-supplier=Digikey; ComponentLink3Description: https://datasheet.ciiva.com/2453/pyu-r-int-thick-7-2453362.pdf?src-supplier=Digikey; ComponentLink4URL: https://datasheet.ciiva.com/12667/pyu-rc0402-51-rohs-l-6-r-12667930.pdf?src-supplier=Mouser; ComponentLink4Description: https://datasheet.ciiva.com/12667/pyu-rc0402-51-rohs-l-6-r-12667930.pdf?src-supplier=Mouser; ComponentLink5URL: https://datasheet.ciiva.com/15189/getdatasheetpartid-323696-15189334.pdf?src-supplier=Verical; ComponentLink5Description: https://datasheet.ciiva.com/15189/getdatasheetpartid-323696-15189334.pdf?src-supplier=Verical; ComponentLink6URL: https://datasheet.ciiva.com/2453/pyu-r-int-thick-7-2453363.pdf?src-supplier=Digikey; ComponentLink6Description: https://datasheet.ciiva.com/2453/pyu-r-int-thick-7-2453363.pdf?src-supplier=Digikey; ComponentLink7URL: https://datasheet.ciiva.com/2453/pyu-r-int-thick-7-2453361.pdf?src-supplier=Digikey; ComponentLink7Description: https://datasheet.ciiva.com/2453/pyu-r-int-thick-7-2453361.pdf?src-supplier=Digikey

## Sheet can.SchDoc
size A4; SheetNumber: 10; SheetTotal: 12
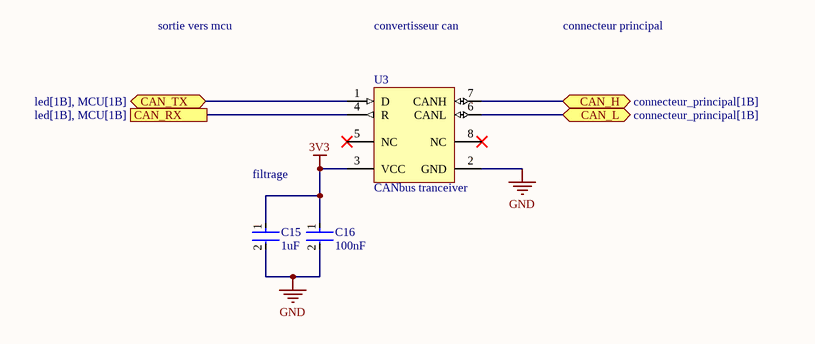
[diagram p6: can.SchDoc]

### Parts
(Parts that share a designator on the sheet are numbered #1, #2 ... from top to bottom, then left to right.)
C15  1uF  [FP-GRM155-0_05-IPC_A]
C16  100nF  [FP-CL278-IPC_A]
U3#1  CANbus tranceiver  [D0008A_M]

### Ports
CAN_H (bidir, see connecteur_principal[1B]), CAN_L (bidir, see connecteur_principal[1B]), CAN_RX (see led[1B], MCU[1B]), CAN_TX (bidir, see led[1B], MCU[1B])

### Nets
3V3: C15.1 C16.1 U3#1.3(VCC)
GND: C15.2 C16.2 U3#1.2(GND)
CAN_RX: U3#1.4(R) ; port CAN_RX
CAN_TX: U3#1.1(D) ; port CAN_TX
NetJ4_5: U3#1.7(CANH) ; port CAN_H
NetJ4_6: U3#1.6(CANL) ; port CAN_L

Not connected (* = marked no-connect by the designer): U3#1 5(NC)* 8(NC)*

### Notes on the sheet
- sortie vers mcu
- convertisseur can
- connecteur principal
- filtrage

### Library data of the parts
C15 = GRM155R61E105MA12D: as C1 on sheet MCU; Supplier: Digikey; Supplier Part Number: 490-10018-1-ND; Manufacturer Part Number: GRM155R61E105MA12D; RoHS: Yes; Category: Ceramic Capacitors; Stock: 2496490; Pricing: 1=0.1, 10=0.066, 50=0.0376, 100=0.0292, 500=0.022, 1000=0.01728, 2500=0.01571, 5000=0.01445 (USD); Mounting Technology: Surface Mount; Case/Package: 0402; Case Code (Metric): 1005; Case Code (Imperial): 0402; Weight: 0.000212oz; Min Operating Temperature: -55°C; Max Operating Temperature: 85°C; Value: 1uF; Packaging: Tape and Reel; Tolerance: 20%; Dielectric: X5R; Termination: SMD/SMT; Voltage Rating (DC): 25V; Package Quantity: 10000; Series: GRM; Length: 0.039inch; Width: 0.02inch; Height: 0.5mm; Thickness: 0.022inch; RoHS Compliant: Yes; ComponentLink1URL: http://www.mouser.com/ds/2/281/c02e-2905.pdf?src-supplier=Mouser; ComponentLink1Description: http://www.mouser.com/ds/2/281/c02e-2905.pdf?src-supplier=Mouser; ComponentLink2URL: https://datasheet.octopart.com/GRM155R61E105MA12D-Murata-datasheet-149523023.pdf?src-supplier=Newark; ComponentLink2Description: https://datasheet.octopart.com/GRM155R61E105MA12D-Murata-datasheet-149523023.pdf?src-supplier=Newark; ComponentLink3URL: https://datasheet.octopart.com/GRM155R61E105MA12D-Murata-datasheet-22122223.pdf?src-supplier=Future+Electronics; ComponentLink3Description: https://datasheet.octopart.com/GRM155R61E105MA12D-Murata-datasheet-22122223.pdf?src-supplier=Future+Electronics; ComponentLink4URL: http://search.murata.co.jp/Ceramy/image/img/A01X/G101/ENG/GRM155R61E105MA12-01.pdf?src-supplier=Digikey; ComponentLink4Description: http://search.murata.co.jp/Ceramy/image/img/A01X/G101/ENG/GRM155R61E105MA12-01.pdf?src-supplier=Digikey
C16 = CL05A104KA5NNNC: as C7 on sheet MCU; Supplier: Digikey; Supplier Part Number: 1276-1043-1-ND; Manufacturer Part Number: CL05A104KA5NNNC; RoHS: Yes; Category: Ceramic Capacitors; Stock: 11930039; Pricing: 1=0.1, 10=0.01, 50=0.0054, 100=0.0042, 500=0.00318, 1000=0.0025, 2500=0.00227, 5000=0.00209 (USD); Mounting Technology: Surface Mount; Case/Package: 0402; Case Code (Metric): 1005; Case Code (Imperial): 0402; Min Operating Temperature: -55°C; Max Operating Temperature: 85°C; Value: 100nF; Packaging: Tape and Reel; Tolerance: 10%; Dielectric: X5R; Voltage: 25V; Series: CL; Construction: Flat; Package Quantity: 1; Voltage Rating (DC): 25V; Length: 1mm; Width: 0.02inch; Height: 0.5mm; Depth: 0.5mm; Thickness: 0.022inch; Radiation Hardening: No; RoHS Compliant: Yes; Lead Free: Lead Free; ComponentLink1URL: https://datasheet.ciiva.com/25802/cl05a104ka5nnnc-25802704.pdf?src-supplier=Digikey; ComponentLink1Description: https://datasheet.ciiva.com/25802/cl05a104ka5nnnc-25802704.pdf?src-supplier=Digikey; ComponentLink2URL: https://datasheet.ciiva.com/16437/cl05a104ka5nnnc-16437369.pdf?src-supplier=Future+Electronics; ComponentLink2Description: https://datasheet.ciiva.com/16437/cl05a104ka5nnnc-16437369.pdf?src-supplier=Future+Electronics; ComponentLink3URL: https://datasheet.ciiva.com/26838/getdatasheetpartid-357412-26838142.pdf?src-supplier=Verical; ComponentLink3Description: https://datasheet.ciiva.com/26838/getdatasheetpartid-357412-26838142.pdf?src-supplier=Verical; ComponentLink4URL: https://datasheet.ciiva.com/26309/mlcc-catalogdownload2013-eng-26309014.pdf?src-supplier=Distrelec; ComponentLink4Description: https://datasheet.ciiva.com/26309/mlcc-catalogdownload2013-eng-26309014.pdf?src-supplier=Distrelec
U3#1 = SN65HVD232DR: EAR99 65HVD232 Tape & Reel (TR) CANbus interface receiver 100mV 17mA 72.603129mg 1Mbps; Manufacturer: Texas Instruments; Min Supply Voltage: 3V; Max Supply Voltage: 3.6V; Number of Transceivers: 1; Simplex/Duplex: Half Duplex; Supplier: Digikey; RoHS: Yes; Category: Interface ICs; Stock: 18370; Pricing: 1=2.5, 10=2.246, 25=2.1184, 100=1.8049, 250=1.6948, 500=1.48294, 1000=1.22872 (USD); Case/Package: D; Pins: 8; Weight: 0.002561oz; Min Operating Temperature: -40°C; Max Operating Temperature: 85°C; Packaging: Tape and Reel; Data Rate: 1Mbps; Package Quantity: 2500; Number of Drivers: 1; Number of Receivers: 1; Series: -; Supply Current: 17mA; Number of Transmit Buffers: 1; Number of Receive Buffers: 1; Receiver Hysteresis: 100mV; Radiation Hardening: No; Lead Free: Lead Free; RoHS Compliant: Yes; Reach SVHC Compliant: No; ComponentLink1URL: https://datasheet.ciiva.com/1771/sn65hvd230-1771113.pdf?src-supplier=Digikey; ComponentLink1Description: https://datasheet.ciiva.com/1771/sn65hvd230-1771113.pdf?src-supplier=Digikey; ComponentLink2URL: https://datasheet.ciiva.com/1771/sn65hvd230-1771112.pdf?src-supplier=Digikey; ComponentLink2Description: https://datasheet.ciiva.com/1771/sn65hvd230-1771112.pdf?src-supplier=Digikey; ComponentLink3URL: https://datasheet.ciiva.com/1771/sn65hvd230-1771114.pdf?src-supplier=Digikey; ComponentLink3Description: https://datasheet.ciiva.com/1771/sn65hvd230-1771114.pdf?src-supplier=Digikey; ComponentLink4URL: https://datasheet.ciiva.com/15149/getdatasheetpartid-107534-15149958.pdf?src-supplier=Verical; ComponentLink4Description: https://datasheet.ciiva.com/15149/getdatasheetpartid-107534-15149958.pdf?src-supplier=Verical; Supplier Part Number: 296-26344-1-ND; Manufacturer Part Number: SN65HVD232DR

## Sheet debug.SchDoc
size A4; SheetNumber: 8; SheetTotal: 12
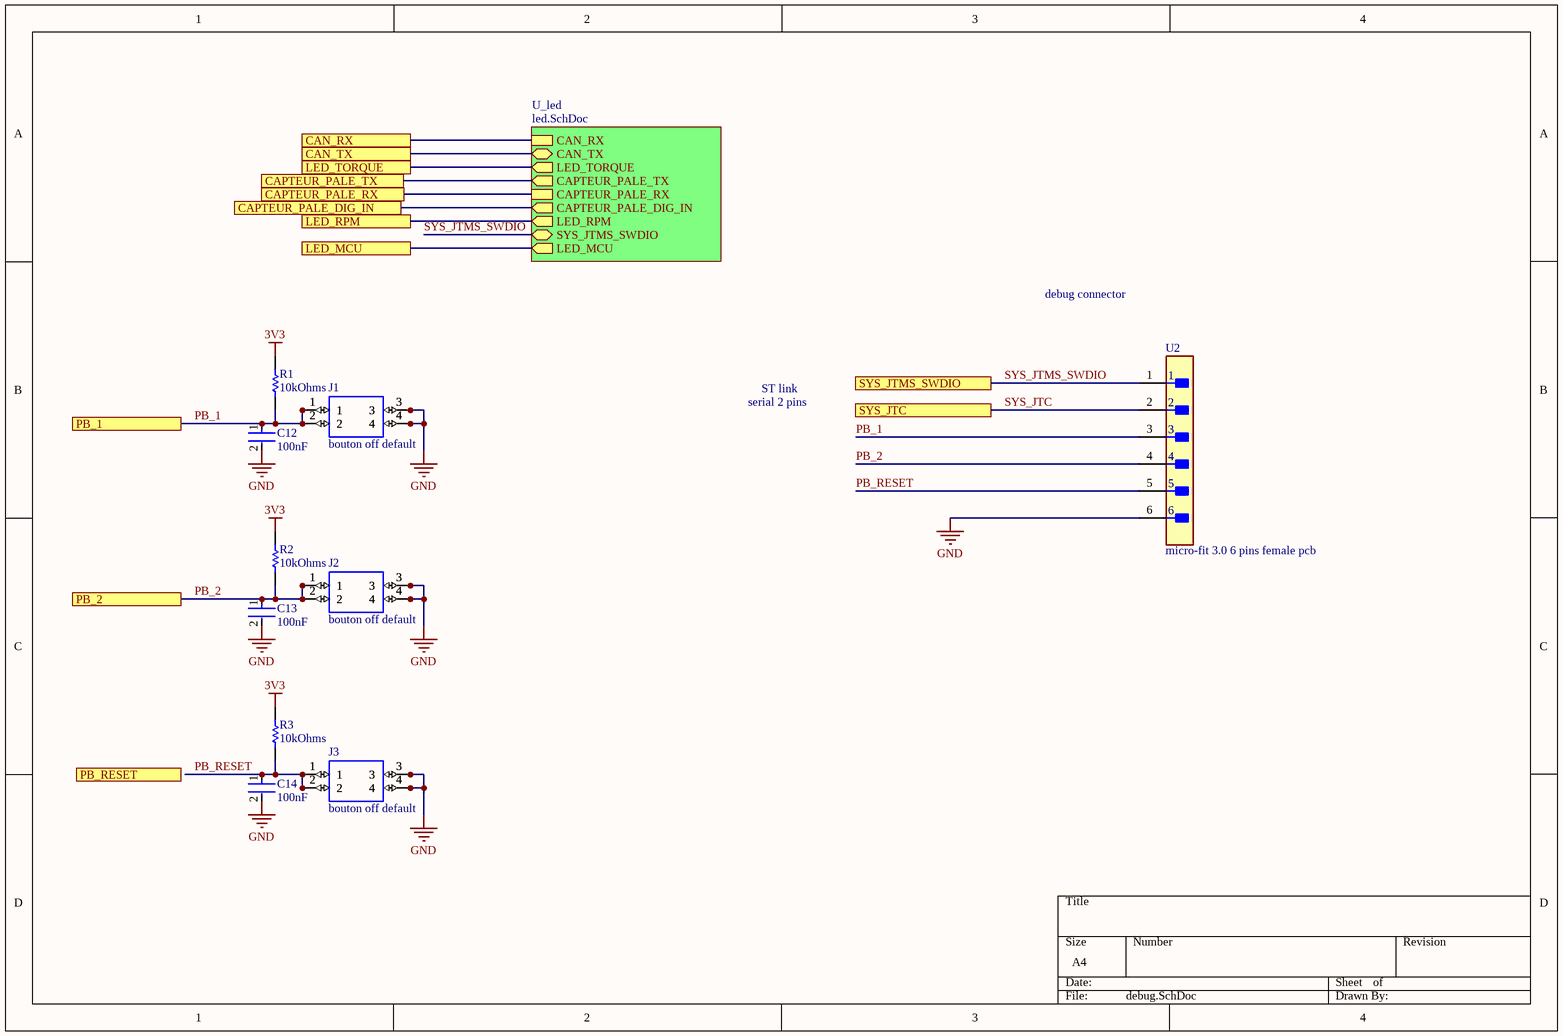
[diagram p7: debug.SchDoc]

### Parts
C12  100nF  [FP-CL278-IPC_A]
C13  100nF  [FP-CL278-IPC_A]
C14  100nF  [FP-CL278-IPC_A]
J1  bouton off default  [PTS810SJG250SMTRLFS]
J2  bouton off default  [PTS810SJG250SMTRLFS]
J3  bouton off default  [PTS810SJG250SMTRLFS]
R1  10kOhms  [FP-RC1005-MFG]
R2  10kOhms  [FP-RC1005-MFG]
R3  10kOhms  [FP-RC1005-MFG]
U2  micro-fit 3.0 6 pins female pcb  [FP-0430450600-MFG]

### Sub-sheets
U_led = led.SchDoc: CAN_RX, CAN_TX (bidir), LED_TORQUE (out), CAPTEUR_PALE_TX (out), CAPTEUR_PALE_RX, CAPTEUR_PALE_DIG_IN (out), LED_RPM (out), SYS_JTMS_SWDIO (bidir), LED_MCU (out)

### Ports
CAN_RX, CAN_TX, CAPTEUR_PALE_DIG_IN, CAPTEUR_PALE_RX, CAPTEUR_PALE_TX, LED_MCU, LED_RPM, LED_TORQUE, PB_1, PB_2, PB_RESET, SYS_JTC, SYS_JTMS_SWDIO

### Nets
3V3: R1.2 R2.2 R3.2
GND: C12.2 C13.2 C14.2 J1.3 J1.4 J2.3 J2.4 J3.3 J3.4 U2.6
PB_1: C12.1 J1.1 J1.2 R1.1 U2.3 ; port PB_1
PB_2: C13.1 J2.1 J2.2 R2.1 U2.4 ; port PB_2
PB_RESET: C14.1 J3.1 J3.2 R3.1 U2.5
SYS_JTC: U2.2 ; port SYS_JTC
SYS_JTMS_SWDIO: U2.1 ; port SYS_JTMS_SWDIO, sheet U_led/SYS_JTMS_SWDIO
NetR6#1_2: port CAN_TX, sheet U_led/CAN_TX
NetR7#1_2: port CAN_RX, sheet U_led/CAN_RX
NetR8#1_2: port CAPTEUR_PALE_TX, sheet U_led/CAPTEUR_PALE_TX
NetR9#1_2: port CAPTEUR_PALE_RX, sheet U_led/CAPTEUR_PALE_RX
NetR10#1_2: port CAPTEUR_PALE_DIG_IN, sheet U_led/CAPTEUR_PALE_DIG_IN
NetR12#1_2: port LED_TORQUE, sheet U_led/LED_TORQUE
NetR13_2: port LED_RPM, sheet U_led/LED_RPM
NetR14_2: port LED_MCU, sheet U_led/LED_MCU

### Notes on the sheet
- debug connector
- serial 2 pins
- ST link

### Library data of the parts
C12-C14 = CL05A104KA5NNNC: as C7 on sheet MCU; Supplier: Digikey; Supplier Part Number: 1276-1043-1-ND; Manufacturer Part Number: CL05A104KA5NNNC; RoHS: Yes; Category: Ceramic Capacitors; Stock: 11930039; Pricing: 1=0.1, 10=0.01, 50=0.0054, 100=0.0042, 500=0.00318, 1000=0.0025, 2500=0.00227, 5000=0.00209 (USD); Mounting Technology: Surface Mount; Case/Package: 0402; Case Code (Metric): 1005; Case Code (Imperial): 0402; Min Operating Temperature: -55°C; Max Operating Temperature: 85°C; Value: 100nF; Packaging: Tape and Reel; Tolerance: 10%; Dielectric: X5R; Voltage: 25V; Series: CL; Construction: Flat; Package Quantity: 1; Voltage Rating (DC): 25V; Length: 1mm; Width: 0.02inch; Height: 0.5mm; Depth: 0.5mm; Thickness: 0.022inch; Radiation Hardening: No; RoHS Compliant: Yes; Lead Free: Lead Free; ComponentLink1URL: https://datasheet.ciiva.com/25802/cl05a104ka5nnnc-25802704.pdf?src-supplier=Digikey; ComponentLink1Description: https://datasheet.ciiva.com/25802/cl05a104ka5nnnc-25802704.pdf?src-supplier=Digikey; ComponentLink2URL: https://datasheet.ciiva.com/16437/cl05a104ka5nnnc-16437369.pdf?src-supplier=Future+Electronics; ComponentLink2Description: https://datasheet.ciiva.com/16437/cl05a104ka5nnnc-16437369.pdf?src-supplier=Future+Electronics; ComponentLink3URL: https://datasheet.ciiva.com/26838/getdatasheetpartid-357412-26838142.pdf?src-supplier=Verical; ComponentLink3Description: https://datasheet.ciiva.com/26838/getdatasheetpartid-357412-26838142.pdf?src-supplier=Verical; ComponentLink4URL: https://datasheet.ciiva.com/26309/mlcc-catalogdownload2013-eng-26309014.pdf?src-supplier=Distrelec; ComponentLink4Description: https://datasheet.ciiva.com/26309/mlcc-catalogdownload2013-eng-26309014.pdf?src-supplier=Distrelec
J1-J3 = PTS810SJK250SMTRLFS: Switch Tactile N.O. SPST Button J-Bend 0.05A 16VDC 50000Cycle 2.55N SMD T/R; Manufacturer: ITT C&K; Mechanical Life: 50000Cycles; Operating Force: 260gf; Current Rating: 50mA; Voltage Rating (DC): 16V; Illumination Type: Non-Illuminated; Switch Travel: 0.15mm; Switch Function: Off-Mom; Supplier: Digikey; Supplier Part Number: CKN10503CT-ND; Manufacturer Part Number: PTS810SJK250SMTRLFS; RoHS: Yes; Category: Tactile Switches; Stock: 151502; Pricing: 1=0.34, 10=0.325, 25=0.306, 100=0.2657, 250=0.24104, 500=0.22422, 1000=0.2018 (USD); Mounting Technology: Surface Mount; Case/Package: SMD/SMT; Color: White; Contact Plating: Silver; Min Operating Temperature: -40°C; Max Operating Temperature: 85°C; Throw Configuration: SPST; Packaging: Tape and Reel; Package Quantity: 2900; Series: PTS810; Lead Free: Lead Free; RoHS Compliant: Yes; ComponentLink1URL: https://datasheet.ciiva.com/18514/pts810-4mar13-18514062.pdf?src-supplier=Digikey; ComponentLink1Description: https://datasheet.ciiva.com/18514/pts810-4mar13-18514062.pdf?src-supplier=Digikey; ComponentLink2URL: https://datasheet.ciiva.com/18514/pts810-4mar13-18514063.pdf?src-supplier=Digikey; ComponentLink2Description: https://datasheet.ciiva.com/18514/pts810-4mar13-18514063.pdf?src-supplier=Digikey; ComponentLink3URL: https://datasheet.ciiva.com/18514/pts810-4mar13-18514061.pdf?src-supplier=Digikey; ComponentLink3Description: https://datasheet.ciiva.com/18514/pts810-4mar13-18514061.pdf?src-supplier=Digikey
R1-R3 = RC1005F103CS: Res Thick Film 0402 10K Ohm 1% 1/16W ±100ppm/°C Molded SMD SMD T/R; Manufacturer: Samsung; Value: 10kR; Power Rating: 63mW; Voltage Rating: 50V; Supplier: Digikey; Supplier Part Number: 1276-3431-1-ND; Manufacturer Part Number: RC1005F103CS; RoHS: Yes; Category: Chip SMD Resistors; Stock: 15479730; Pricing: 1=0.1, 10=0.024, 50=0.0156, 100=0.0132, 500=0.00922, 1000=0.00803, 5000=0.00598 (USD); Case/Package: 0402; Case Code (Metric): 1005; Case Code (Imperial): 0402; Contact Plating: Tin; Min Operating Temperature: -55°C; Max Operating Temperature: 155°C; Tolerance: 1%; Packaging: Tape and Reel; Package Quantity: 1; Number of Terminations: 2; Max Power Dissipation: 63mW; Temperature Coefficient: 100ppm/°C; Features: Moisture Resistant; Series: RC; Construction: Rectangular; Voltage Rating (DC): 50V; Length: 0.039inch; Width: 0.02inch; Height: 0.016inch; Depth: 0.5mm; Thickness: 350um; Radiation Hardening: No; Military Standard: Not; RoHS Compliant: Yes; Lead Free: 5697LeadFree; ComponentLink1URL: https://datasheet.ciiva.com/15196/getdatasheetpartid-504789-15196214.pdf?src-supplier=Verical; ComponentLink1Description: https://datasheet.ciiva.com/15196/getdatasheetpartid-504789-15196214.pdf?src-supplier=Verical; ComponentLink2URL: https://datasheet.ciiva.com/16481/rcseries-16481007.pdf?src-supplier=Future+Electronics; ComponentLink2Description: https://datasheet.ciiva.com/16481/rcseries-16481007.pdf?src-supplier=Future+Electronics
U2 = 430450600: as J7 on sheet encodeur_pale; Supplier: Digikey; Supplier Part Number: WM1815-ND; RoHS: Yes; Category: Headers and Wire Housings; Stock: 3053; Pricing: 1=2.2, 10=1.875, 80=1.54863, 1728=1.18185, 5184=1.08404 (USD); Mounting Technology: Through Hole; Case/Package: SMC; Contact Material: Brass,Tin; Contact Plating: Tin; Housing Color: Black; Housing Material: Thermoplastic; Color: Black; Material: 4301ConductorMaterial; Min Operating Temperature: -40°C; Max Operating Temperature: 105°C; Number of Rows: 2; Packaging: Tray; Termination: Solder; Orientation: Right Angle; Package Quantity: 1728; Max Current Rating: 5A; Number of Circuits: 6; Number of Contacts: 6; Series: 43045; Voltage Rating (DC): 250V; Diameter: 3mm; Length: 13.15mm; Height: 8.77mm; Pitch: 3mm; Depth: 12.2mm; Row Spacing: 3mm; Radiation Hardening: No; Flammability Rating: UL94 V-0; RoHS Compliant: Yes; Reach SVHC Compliant: Unknown; Halogen Free: 5696HalogenFree; Lead Free: 5697LeadFree; Parameter 1: *